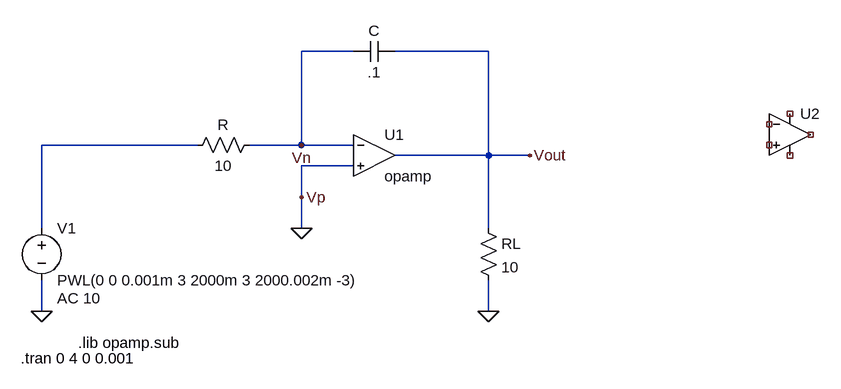
[diagram p0: schematic Project2.asc]
Project2.asc, the LTspice schematic file:
Version 4
SHEET 1 1284 680
WIRE 560 -160 480 -160
WIRE 768 -160 624 -160
WIRE 320 -16 80 -16
WIRE 480 -16 480 -160
WIRE 480 -16 400 -16
WIRE 560 -16 480 -16
WIRE 768 0 768 -160
WIRE 768 0 624 0
WIRE 832 0 768 0
WIRE 560 16 480 16
WIRE 480 64 480 16
WIRE 80 112 80 -16
WIRE 480 112 480 64
WIRE 768 112 768 0
WIRE 80 240 80 192
WIRE 768 240 768 192
FLAG 80 240 0
FLAG 768 240 0
FLAG 480 112 0
FLAG 832 0 Vout
FLAG 480 -16 Vn
FLAG 480 64 Vp
SYMBOL voltage 80 96 R0
WINDOW 123 24 124 Left 2
WINDOW 39 0 0 Left 0
SYMATTR Value2 AC 10
SYMATTR InstName V1
SYMATTR Value PWL(0 0 0.001m 3 2000m 3 2000.002m -3)
SYMBOL OpAmps\\opamp 592 -64 R0
SYMATTR InstName U1
SYMBOL res 416 -32 R90
WINDOW 0 0 56 VBottom 2
WINDOW 3 32 56 VTop 2
SYMATTR InstName R
SYMATTR Value 10
SYMBOL res 752 96 R0
SYMATTR InstName RL
SYMATTR Value 10
SYMBOL cap 624 -176 R90
WINDOW 0 0 32 VBottom 2
WINDOW 3 32 32 VTop 2
SYMATTR InstName C
SYMATTR Value .1
SYMBOL OpAmps\\UniversalOpamp2 1232 -32 R0
SYMATTR InstName U2
TEXT 136 288 Left 2 !.lib opamp.sub
TEXT 48 312 Left 2 !.tran 0 4 0 0.001

The netlist it stands for:
* Project2.asc
V1 N001 0 PWL(0 0 0.001m 3 2000m 3 2000.002m -3) AC 10
XU1 Vn 0 Vout opamp Aol=100K GBW=10Meg  ; pins invin noninvin out
R Vn N001 10
RL Vout 0 10
C Vout Vn .1
XU2 NC_01 NC_02 NC_03 NC_04 NC_05 level.2 Avol=1Meg GBW=10Meg Slew=10Meg ilimit=25m rail=0 Vos=0 phimargin=45 en=0 enk=0 in=0 ink=0 Rin=500Meg  ; pins IN+ IN- V+ V- OUT
.lib opamp.sub
.tran 0 4 0 0.001
.lib UniversalOpamps2.sub
.backanno
.end